# Altium schematic sheet RDAC.SchDoc
size A4
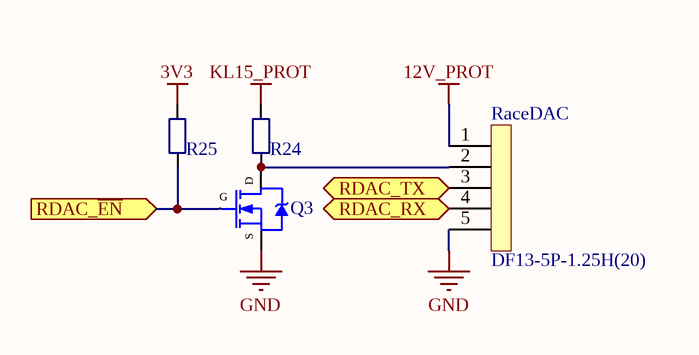
[diagram p0: RDAC.SchDoc]

## Parts
Q3  2N7002  [SOT95P245X110-3N]  (value not drawn)
R24  .Resistor  [R0603H05_M]  (value not drawn)
R25  .Resistor  [R0603H05_M]  (value not drawn)
RaceDAC  DF13-5P-1.25H(20)  [DF13-5P-1.25H(20)]

## Ports
RDAC_RX (in), RDAC_TX (out), RDAC_~{EN} (in)

## Nets
3V3: R25.1
12V_PROT: RaceDAC.1
GND: Q3.2(S) RaceDAC.5
KL15_PROT: R24.1
RDAC_~{EN}: Q3.1(G) R25.2 ; port RDAC_~{EN}
RDAC_RX: RaceDAC.4 ; port RDAC_RX
RDAC_TX: RaceDAC.3 ; port RDAC_TX
NetQ3_3: Q3.3(D) R24.2 RaceDAC.2

## Library data of the parts
Q3 = 2N7002: N-Channel Enhancement Mode Field Effect Transistor; Manufactor: Texas Instruments
RaceDAC = Hirose DF13-5P-1.25H(20): Circuits: 5; Connector Orientation: Right Angle; Model: DF13-5P-1.25H(20); Mounting Style: SMT